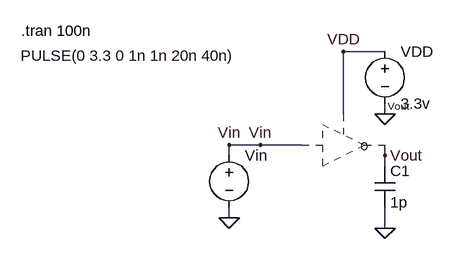
[diagram p0: schematic lab2-task2.asc]
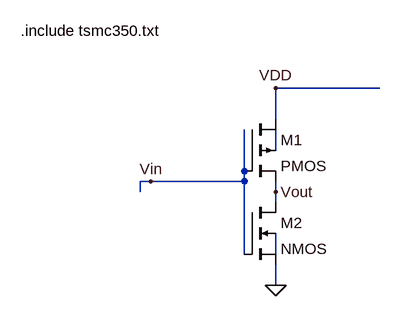
[diagram p1: sub-circuit symb.asc]
lab2-task2.asc, the LTspice schematic file:
Version 4
SHEET 1 880 680
WIRE 400 176 336 176
WIRE 336 272 336 176
WIRE 400 272 400 256
WIRE 208 320 160 320
WIRE 272 320 208 320
WIRE 160 336 160 320
WIRE 400 336 400 320
WIRE 400 352 400 336
WIRE 160 432 160 416
WIRE 400 448 400 416
FLAG 400 272 0
FLAG 160 432 0
FLAG 400 448 0
FLAG 160 320 Vin
FLAG 336 176 VDD
FLAG 208 320 Vin
FLAG 400 336 Vout
SYMBOL symb 336 320 R0
SYMATTR InstName Vout
SYMBOL Voltage 160 320 R0
WINDOW 3 -321 -138 Left 2
SYMATTR Value PULSE(0 3.3 0 1n 1n 20n 40n)
SYMATTR InstName Vin
SYMBOL Voltage 400 160 R0
SYMATTR InstName VDD
SYMATTR Value 3.3v
SYMBOL Cap 384 352 R0
SYMATTR InstName C1
SYMATTR Value 1p
TEXT -160 144 Left 2 !.tran 100n

symb.asc, the sub-circuit schematic file:
Version 4
SHEET 1 880 680
WIRE 560 176 400 176
WIRE 400 224 400 176
WIRE 400 272 400 240
WIRE 352 304 352 240
WIRE 208 320 192 320
WIRE 352 320 352 304
WIRE 352 320 208 320
WIRE 192 336 192 320
WIRE 400 336 400 320
WIRE 400 352 400 336
WIRE 352 432 352 320
WIRE 400 432 400 400
WIRE 400 480 400 448
FLAG 400 480 0
FLAG 208 320 Vin
FLAG 400 176 VDD
FLAG 400 336 Vout
SYMBOL pmos4 352 224 R0
SYMATTR InstName M1
SYMATTR Value2 l=350n w=2u
SYMBOL nmos4 352 352 R0
SYMATTR InstName M2
SYMATTR Value2 l=350n w=1u
TEXT 8 88 Left 2 !.include tsmc350.txt

The netlist it stands for:
* lab2-task2.asc
XVout Vin VDD Vout symb
Vin Vin 0 PULSE(0 3.3 0 1n 1n 20n 40n)
VDD VDD 0 3.3v
C1 Vout 0 1p

* block symbol definitions
.subckt symb Vin VDD Vout
M1 VDD Vin Vout N001 PMOS l=350n w=2u
M2 Vout Vin 0 N002 NMOS l=350n w=1u
.include tsmc350.txt
.ends symb

.model NMOS NMOS
.model PMOS PMOS
.lib standard.mos
.tran 100n
.backanno
.end